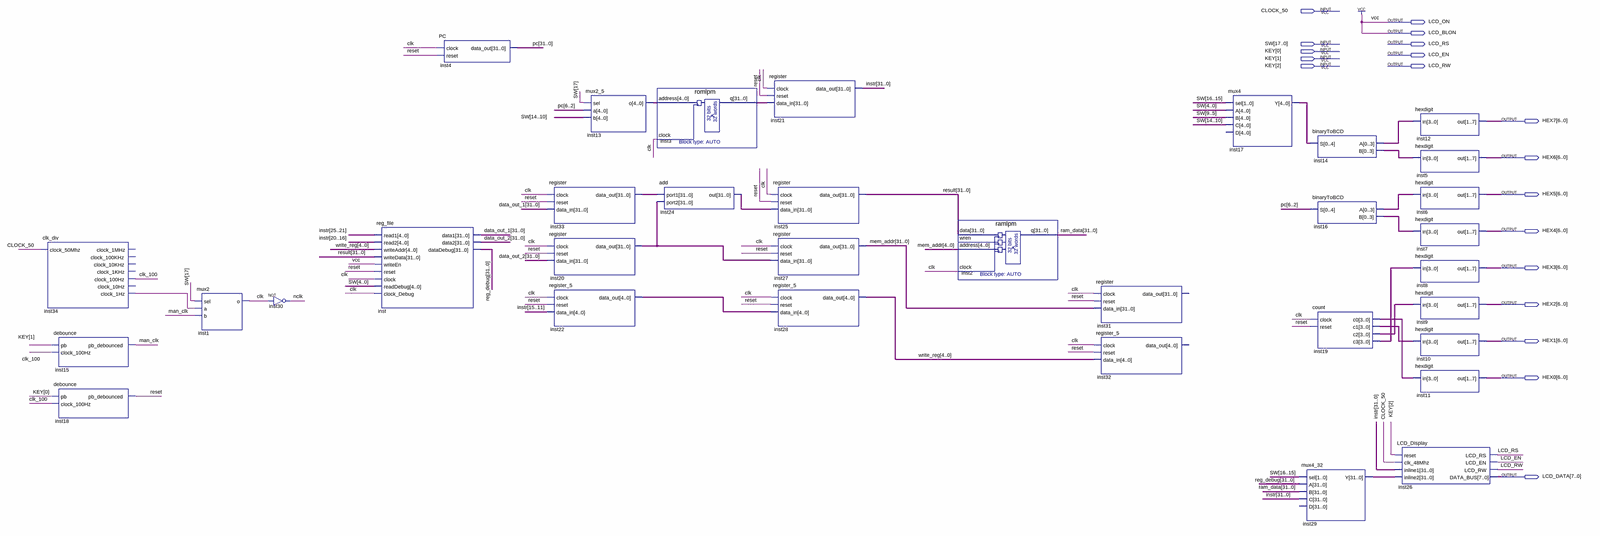
[diagram p0: schematic sheet, whole]
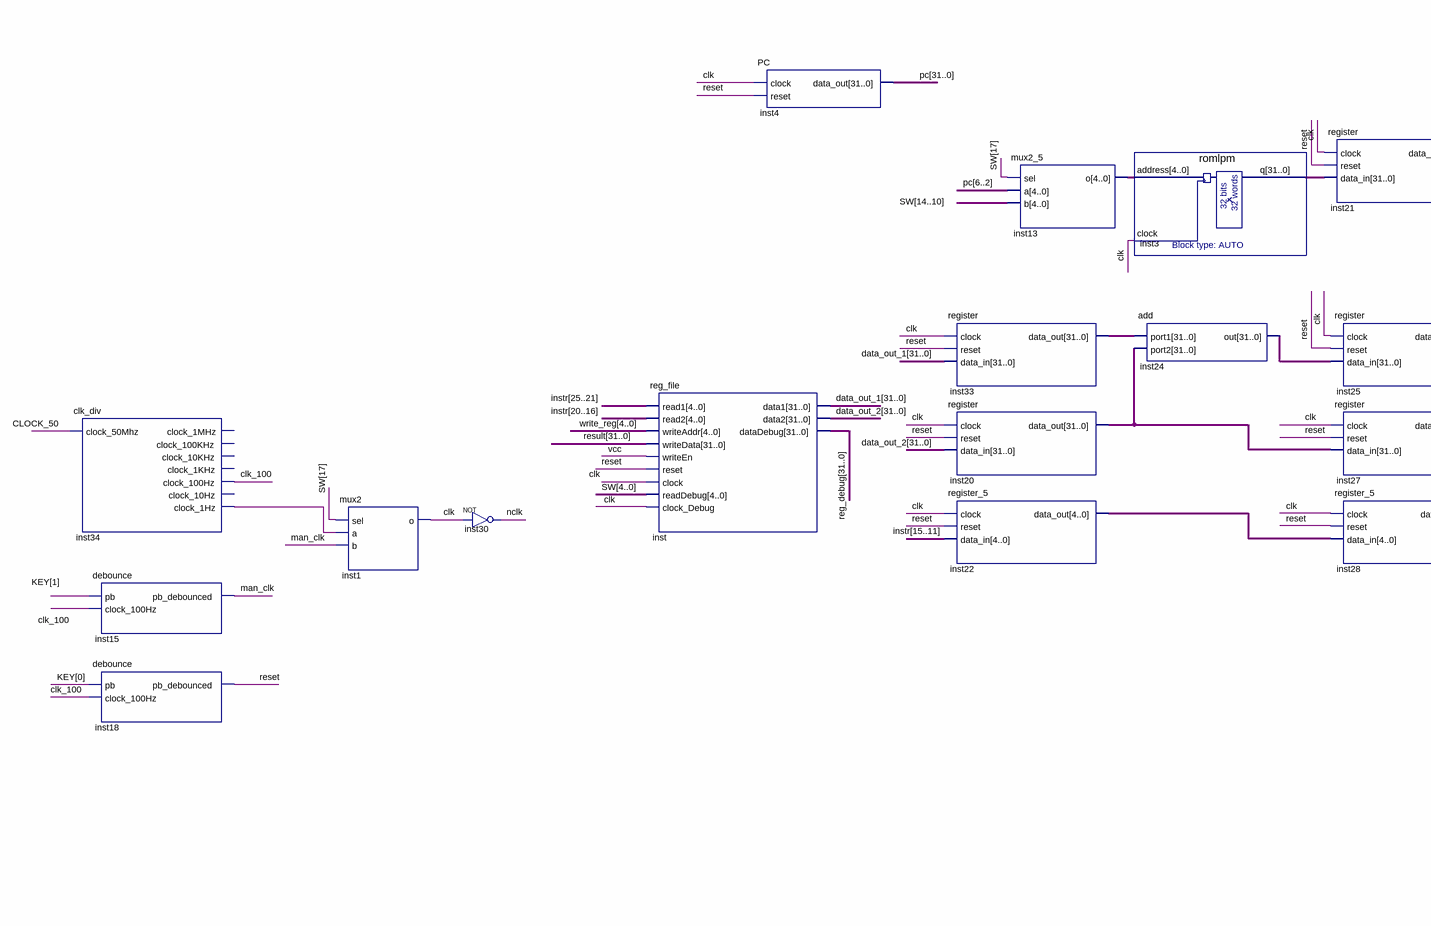
[diagram p1: schematic sheet, left part]
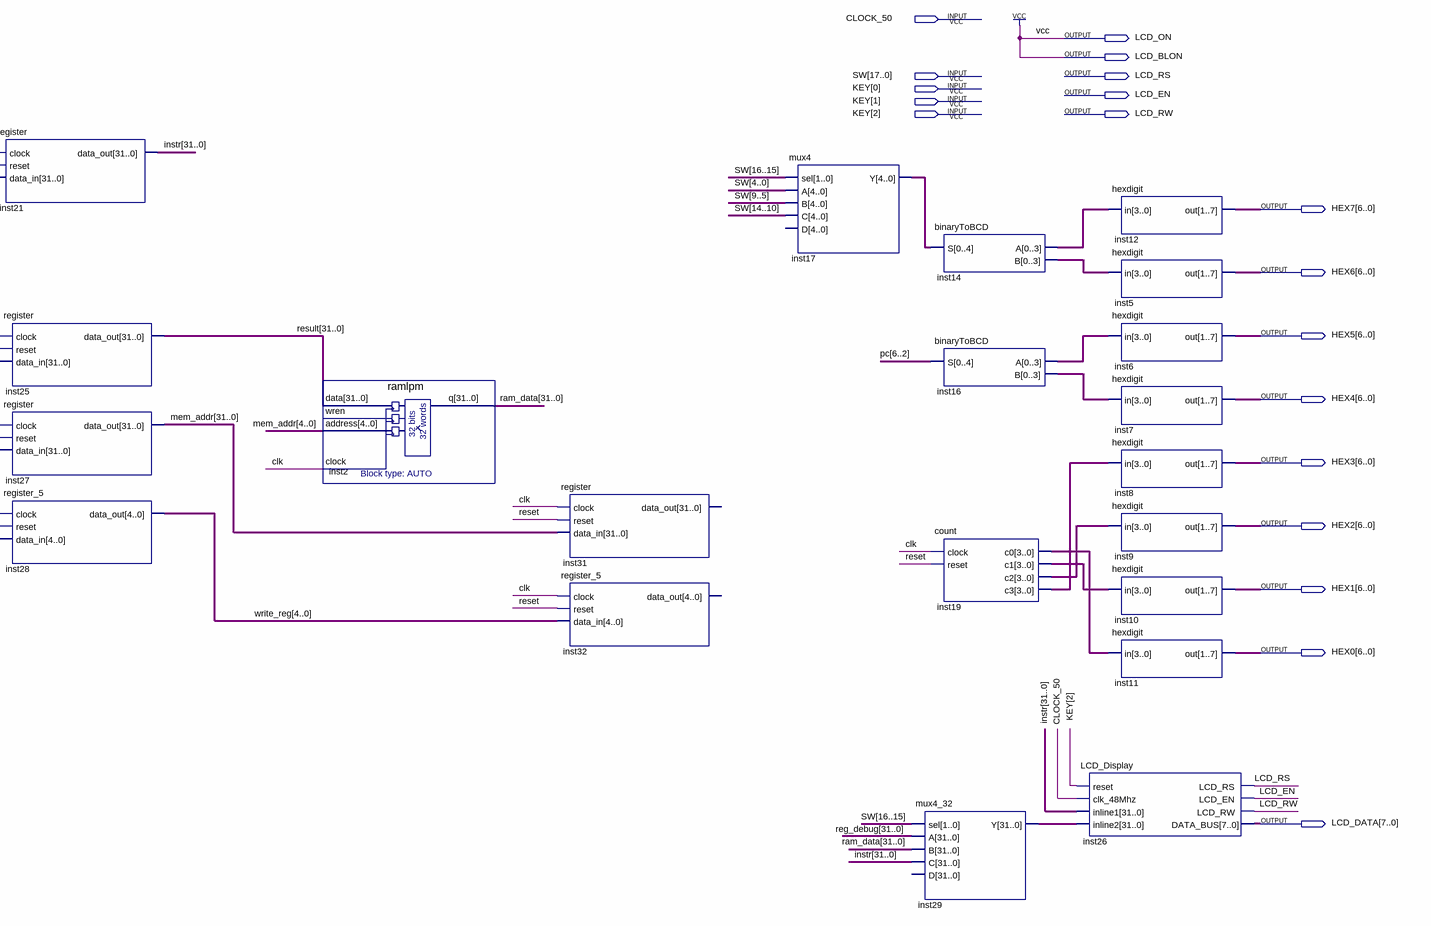
[diagram p2: schematic sheet, right part]
// Quartus schematic Lab5.bdf as structural Verilog: 34 symbols, 19 pins
module Lab5 (
  input  CLOCK_50,
  input  [17:0] SW,
  input  [2:0] KEY,
  output LCD_ON,
  output LCD_BLON,
  output LCD_RS,
  output LCD_EN,
  output LCD_RW,
  output [6:0] HEX7,
  output [6:0] HEX6,
  output [6:0] HEX5,
  output [6:0] HEX4,
  output [6:0] HEX3,
  output [6:0] HEX2,
  output [6:0] HEX1,
  output [6:0] HEX0,
  output [7:0] LCD_DATA
);

  wire clk, clk_100, inst34_clock_1hz, man_clk, nclk, reset;
  wire [3:0] inst14_a, inst14_b, inst16_a, inst16_b, inst19_c0, inst19_c1, inst19_c2, inst19_c3;
  wire [4:0] inst13_o, inst17_y, inst22_data_out, write_reg;
  wire [31:0] data_out_1, data_out_2, inst3_q, inst20_data_out, inst24_out, inst29_y, inst33_data_out, instr,
       mem_addr, pc, ram_data, reg_debug, result;

  clk_div inst34 (
    .clock_50Mhz(CLOCK_50), .clock_100Hz(clk_100), .clock_1Hz(inst34_clock_1hz));  // open: clock_1MHz, clock_100KHz, clock_10KHz, clock_1KHz, clock_10Hz
  debounce inst15 (.pb(KEY[1]), .clock_100Hz(clk_100), .pb_debounced(man_clk));
  debounce inst18 (.pb(KEY[0]), .clock_100Hz(clk_100), .pb_debounced(reset));
  mux2 inst1 (.sel(SW[17]), .a(inst34_clock_1hz), .b(man_clk), .o(clk));
  not inst30 (nclk, clk);
  reg_file inst (
    .read1(instr[25:21]), .read2(instr[20:16]), .writeAddr(write_reg), .writeData(result), .writeEn(1'b1),
    .reset(reset), .clock(clk), .readDebug(SW[4:0]), .clock_Debug(clk), .data1(data_out_1),
    .data2(data_out_2), .dataDebug(reg_debug));
  PC inst4 (.clock(clk), .reset(reset), .data_out(pc));
  register inst33 (.clock(clk), .reset(reset), .data_in(data_out_1), .data_out(inst33_data_out));
  register inst20 (.clock(clk), .reset(reset), .data_in(data_out_2), .data_out(inst20_data_out));
  register_5 inst22 (.clock(clk), .reset(reset), .data_in(instr[15:11]), .data_out(inst22_data_out));
  mux2_5 inst13 (.sel(SW[17]), .a(pc[6:2]), .b(SW[14:10]), .o(inst13_o));
  romlpm inst3 (.address(inst13_o), .clock(clk), .q(inst3_q));
  add inst24 (.port1(inst33_data_out), .port2(inst20_data_out), .out(inst24_out));
  register inst21 (.clock(clk), .reset(reset), .data_in(inst3_q), .data_out(instr));
  register inst25 (.clock(clk), .reset(reset), .data_in(inst24_out), .data_out(result));
  register inst27 (.clock(clk), .reset(reset), .data_in(inst20_data_out), .data_out(mem_addr));
  register_5 inst28 (.clock(clk), .reset(reset), .data_in(inst22_data_out), .data_out(write_reg));
  ramlpm inst2 (.data(result), .address(mem_addr[4:0]), .clock(clk), .q(ram_data));  // open: wren
  register inst31 (.clock(clk), .reset(reset), .data_in(mem_addr));  // open: data_out
  register_5 inst32 (.clock(clk), .reset(reset), .data_in(write_reg));  // open: data_out
  mux4 inst17 (.sel(SW[16:15]), .A(SW[4:0]), .B(SW[9:5]), .C(SW[14:10]), .Y(inst17_y));  // open: D
  mux4_32 inst29 (.sel(SW[16:15]), .A(reg_debug), .B(ram_data), .C(instr), .Y(inst29_y));  // open: D
  binaryToBCD inst14 (.S(inst17_y), .A(inst14_a), .B(inst14_b));
  binaryToBCD inst16 (.S(pc[6:2]), .A(inst16_a), .B(inst16_b));
  count inst19 (.clock(clk), .reset(reset), .c0(inst19_c0), .c1(inst19_c1), .c2(inst19_c2), .c3(inst19_c3));
  hexdigit inst12 (.in(inst14_a), .out(HEX7));
  hexdigit inst5 (.in(inst14_b), .out(HEX6));
  hexdigit inst6 (.in(inst16_a), .out(HEX5));
  hexdigit inst7 (.in(inst16_b), .out(HEX4));
  hexdigit inst8 (.in(inst19_c3), .out(HEX3));
  hexdigit inst9 (.in(inst19_c2), .out(HEX2));
  hexdigit inst10 (.in(inst19_c1), .out(HEX1));
  hexdigit inst11 (.in(inst19_c0), .out(HEX0));
  LCD_Display inst26 (
    .reset(KEY[2]), .clk_48Mhz(CLOCK_50), .inline1(instr), .inline2(inst29_y), .LCD_RS(LCD_RS),
    .LCD_EN(LCD_EN), .LCD_RW(LCD_RW), .DATA_BUS(LCD_DATA));

  assign LCD_BLON = 1'b1;
  assign LCD_ON = 1'b1;
endmodule
